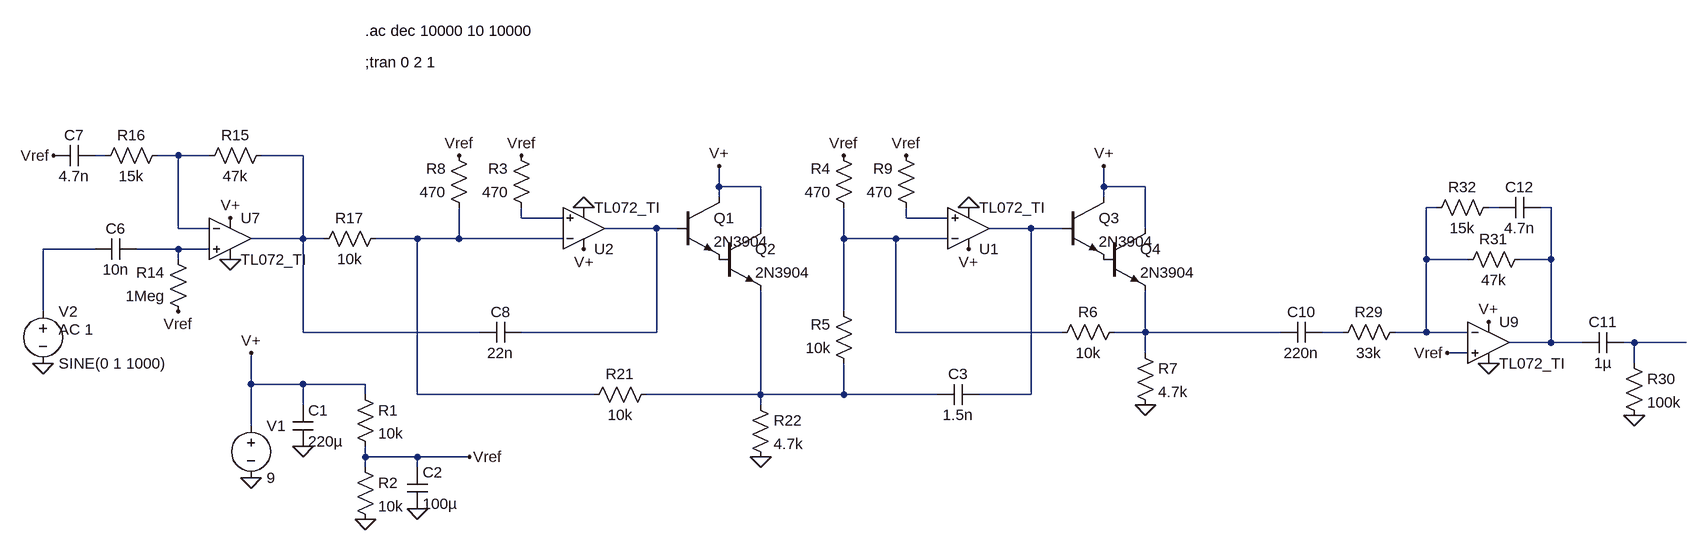
[diagram p0: schematic runooffgroove_tri_vibe_main2.asc]
runooffgroove_tri_vibe_main2.asc, the LTspice schematic file:
Version 4
SHEET 1 2644 680
WIRE 208 -544 192 -544
WIRE 320 -544 288 -544
WIRE 368 -544 320 -544
WIRE 512 -544 448 -544
WIRE 1152 -496 1152 -528
WIRE 1216 -496 1152 -496
WIRE 1744 -496 1744 -528
WIRE 1808 -496 1744 -496
WIRE 1152 -480 1152 -496
WIRE 1744 -480 1744 -496
WIRE 2256 -464 2240 -464
WIRE 2352 -464 2336 -464
WIRE 2432 -464 2416 -464
WIRE 848 -448 848 -464
WIRE 912 -448 848 -448
WIRE 1440 -448 1440 -464
WIRE 1504 -448 1440 -448
WIRE 320 -432 320 -544
WIRE 368 -432 320 -432
WIRE 1056 -432 976 -432
WIRE 1088 -432 1056 -432
WIRE 1216 -432 1216 -496
WIRE 1632 -432 1568 -432
WIRE 1680 -432 1632 -432
WIRE 1808 -432 1808 -496
WIRE 512 -416 512 -544
WIRE 512 -416 432 -416
WIRE 544 -416 512 -416
WIRE 688 -416 624 -416
WIRE 752 -416 752 -464
WIRE 752 -416 688 -416
WIRE 912 -416 752 -416
WIRE 1344 -416 1344 -464
WIRE 1424 -416 1344 -416
WIRE 1504 -416 1424 -416
WIRE 192 -400 112 -400
WIRE 320 -400 256 -400
WIRE 368 -400 320 -400
WIRE 320 -384 320 -400
WIRE 2240 -384 2240 -464
WIRE 2304 -384 2240 -384
WIRE 2432 -384 2432 -464
WIRE 2432 -384 2384 -384
WIRE 112 -304 112 -400
WIRE 1344 -304 1344 -416
WIRE 512 -272 512 -416
WIRE 784 -272 512 -272
WIRE 1056 -272 1056 -432
WIRE 1056 -272 848 -272
WIRE 1424 -272 1424 -416
WIRE 1680 -272 1424 -272
WIRE 1808 -272 1808 -336
WIRE 1808 -272 1760 -272
WIRE 2016 -272 1808 -272
WIRE 2112 -272 2080 -272
WIRE 2240 -272 2240 -384
WIRE 2240 -272 2192 -272
WIRE 2304 -272 2240 -272
WIRE 2432 -256 2432 -384
WIRE 2432 -256 2368 -256
WIRE 2480 -256 2432 -256
WIRE 2560 -256 2544 -256
WIRE 2640 -256 2560 -256
WIRE 1808 -240 1808 -272
WIRE 2304 -240 2272 -240
WIRE 2560 -224 2560 -256
WIRE 432 -192 432 -240
WIRE 512 -192 432 -192
WIRE 608 -192 512 -192
WIRE 608 -176 608 -192
WIRE 688 -176 688 -416
WIRE 960 -176 688 -176
WIRE 1216 -176 1216 -336
WIRE 1216 -176 1040 -176
WIRE 1344 -176 1344 -224
WIRE 1344 -176 1216 -176
WIRE 1488 -176 1344 -176
WIRE 1632 -176 1632 -432
WIRE 1632 -176 1552 -176
WIRE 512 -160 512 -192
WIRE 1216 -160 1216 -176
WIRE 432 -128 432 -192
WIRE 608 -80 608 -96
WIRE 688 -80 608 -80
WIRE 768 -80 688 -80
WIRE 608 -64 608 -80
WIRE 688 -64 688 -80
FLAG 432 -48 0
FLAG 512 -96 0
FLAG 608 16 0
FLAG 688 0 0
FLAG 432 -240 V+
FLAG 768 -80 Vref
FLAG 112 -224 0
FLAG 400 -448 V+
FLAG 400 -384 0
FLAG 320 -304 Vref
FLAG 128 -544 Vref
FLAG 1216 -80 0
FLAG 2336 -288 V+
FLAG 2336 -224 0
FLAG 2272 -240 Vref
FLAG 2560 -144 0
FLAG 944 -464 0
FLAG 944 -400 V+
FLAG 1152 -528 V+
FLAG 1536 -464 0
FLAG 1536 -400 V+
FLAG 1744 -528 V+
FLAG 1808 -160 0
FLAG 752 -544 Vref
FLAG 848 -544 Vref
FLAG 1344 -544 Vref
FLAG 1440 -544 Vref
SYMBOL voltage 432 -144 R0
WINDOW 123 0 0 Left 2
WINDOW 39 0 0 Left 2
SYMATTR InstName V1
SYMATTR Value 9
SYMBOL cap 496 -160 R0
SYMATTR InstName C1
SYMATTR Value 220µ
SYMBOL res 592 -192 R0
SYMATTR InstName R1
SYMATTR Value 10k
SYMBOL res 592 -80 R0
SYMATTR InstName R2
SYMATTR Value 10k
SYMBOL cap 672 -64 R0
SYMATTR InstName C2
SYMATTR Value 100µ
SYMBOL voltage 112 -320 R0
WINDOW 123 24 44 Left 2
WINDOW 39 0 0 Left 2
SYMATTR Value2 AC 1
SYMATTR InstName V2
SYMATTR Value SINE(0 1 1000)
SYMBOL cap 256 -416 R90
WINDOW 0 0 32 VBottom 2
WINDOW 3 32 32 VTop 2
SYMATTR InstName C6
SYMATTR Value 10n
SYMBOL res 336 -288 R180
WINDOW 0 36 76 Left 2
WINDOW 3 36 40 Left 2
SYMATTR InstName R14
SYMATTR Value 1Meg
SYMBOL EXTRA\\AudioOpamp\\TI\\TL072_TI 400 -416 R0
SYMATTR InstName U7
SYMBOL res 464 -560 R90
WINDOW 0 0 56 VBottom 2
WINDOW 3 32 56 VTop 2
SYMATTR InstName R15
SYMATTR Value 47k
SYMBOL res 192 -528 R270
WINDOW 0 32 56 VTop 2
WINDOW 3 0 56 VBottom 2
SYMATTR InstName R16
SYMATTR Value 15k
SYMBOL cap 192 -560 R90
WINDOW 0 0 32 VBottom 2
WINDOW 3 32 32 VTop 2
SYMATTR InstName C7
SYMATTR Value 4.7n
SYMBOL res 640 -432 R90
WINDOW 0 0 56 VBottom 2
WINDOW 3 32 56 VTop 2
SYMATTR InstName R17
SYMATTR Value 10k
SYMBOL cap 848 -288 R90
WINDOW 0 0 32 VBottom 2
WINDOW 3 32 32 VTop 2
SYMATTR InstName C8
SYMATTR Value 22n
SYMBOL res 1056 -192 R90
WINDOW 0 0 56 VBottom 2
WINDOW 3 32 56 VTop 2
SYMATTR InstName R21
SYMATTR Value 10k
SYMBOL res 1200 -176 R0
SYMATTR InstName R22
SYMATTR Value 4.7k
SYMBOL cap 2080 -288 R90
WINDOW 0 0 32 VBottom 2
WINDOW 3 32 32 VTop 2
SYMATTR InstName C10
SYMATTR Value 220n
SYMBOL res 2208 -288 R90
WINDOW 0 0 56 VBottom 2
WINDOW 3 32 56 VTop 2
SYMATTR InstName R29
SYMATTR Value 33k
SYMBOL EXTRA\\AudioOpamp\\TI\\TL072_TI 2336 -256 R0
SYMATTR InstName U9
SYMBOL cap 2544 -272 R90
WINDOW 0 0 32 VBottom 2
WINDOW 3 32 32 VTop 2
SYMATTR InstName C11
SYMATTR Value 1µ
SYMBOL res 2544 -240 R0
SYMATTR InstName R30
SYMATTR Value 100k
SYMBOL res 2400 -400 R90
WINDOW 0 0 56 VBottom 2
WINDOW 3 32 56 VTop 2
SYMATTR InstName R31
SYMATTR Value 47k
SYMBOL res 2352 -480 R90
WINDOW 0 0 56 VBottom 2
WINDOW 3 32 56 VTop 2
SYMATTR InstName R32
SYMATTR Value 15k
SYMBOL cap 2416 -480 R90
WINDOW 0 0 32 VBottom 2
WINDOW 3 32 32 VTop 2
SYMATTR InstName C12
SYMATTR Value 4.7n
SYMBOL EXTRA\\AudioOpamp\\TI\\TL072_TI 944 -432 M180
SYMATTR InstName U2
SYMBOL npn 1088 -480 R0
SYMATTR InstName Q1
SYMATTR Value 2N3904
SYMBOL npn 1152 -432 R0
SYMATTR InstName Q2
SYMATTR Value 2N3904
SYMBOL EXTRA\\AudioOpamp\\TI\\TL072_TI 1536 -432 M180
SYMATTR InstName U1
SYMBOL npn 1680 -480 R0
SYMATTR InstName Q3
SYMATTR Value 2N3904
SYMBOL npn 1744 -432 R0
SYMATTR InstName Q4
SYMATTR Value 2N3904
SYMBOL res 1360 -208 R180
WINDOW 0 36 76 Left 2
WINDOW 3 36 40 Left 2
SYMATTR InstName R5
SYMATTR Value 10k
SYMBOL cap 1552 -192 R90
WINDOW 0 0 32 VBottom 2
WINDOW 3 32 32 VTop 2
SYMATTR InstName C3
SYMATTR Value 1.5n
SYMBOL res 1776 -288 R90
WINDOW 0 0 56 VBottom 2
WINDOW 3 32 56 VTop 2
SYMATTR InstName R6
SYMATTR Value 10k
SYMBOL res 1792 -256 R0
SYMATTR InstName R7
SYMATTR Value 4.7k
SYMBOL res 768 -448 R180
WINDOW 0 36 76 Left 2
WINDOW 3 36 40 Left 2
SYMATTR InstName R8
SYMATTR Value 470
SYMBOL res 864 -448 R180
WINDOW 0 36 76 Left 2
WINDOW 3 36 40 Left 2
SYMATTR InstName R3
SYMATTR Value 470
SYMBOL res 1360 -448 R180
WINDOW 0 36 76 Left 2
WINDOW 3 36 40 Left 2
SYMATTR InstName R4
SYMATTR Value 470
SYMBOL res 1456 -448 R180
WINDOW 0 36 76 Left 2
WINDOW 3 36 40 Left 2
SYMATTR InstName R9
SYMATTR Value 470
TEXT 608 -688 Left 2 !;tran 0 2 1
TEXT 608 -736 Left 2 !.ac dec 10000 10 10000

The netlist it stands for:
* runooffgroove_tri_vibe_main2.asc
V1 V+ 0 9
C1 V+ 0 220µ
R1 V+ Vref 10k
R2 Vref 0 10k
C2 Vref 0 100µ
V2 N013 0 SINE(0 1 1000) AC 1
C6 N014 N013 10n
R14 Vref N014 1Meg
* U7: TL072_TI (symbol EXTRA\AudioOpamp\TI\TL072_TI not available, pins judged from their places): In+=N014 In-=N002 V+=V+ V-=0 OUT=N003
R15 N003 N002 47k
R16 N001 N002 15k
C7 N001 Vref 4.7n
R17 N011 N003 10k
C8 N009 N003 22n
R21 N018 N011 10k
R22 N018 0 4.7k
C10 N016 N015 220n
R29 N004 N016 33k
* U9: TL072_TI (symbol EXTRA\AudioOpamp\TI\TL072_TI not available, pins judged from their places): In+=Vref In-=N004 V+=V+ V-=0 OUT=N006
C11 N017 N006 1µ
R30 N017 0 100k
R31 N006 N004 47k
R32 N005 N004 15k
C12 N006 N005 4.7n
* U2: TL072_TI (symbol EXTRA\AudioOpamp\TI\TL072_TI not available, pins judged from their places): In+=N007 In-=N011 V+=V+ V-=0 OUT=N009
Q1 V+ N009 P001 0 2N3904
Q2 V+ P001 N018 0 2N3904
* U1: TL072_TI (symbol EXTRA\AudioOpamp\TI\TL072_TI not available, pins judged from their places): In+=N008 In-=N012 V+=V+ V-=0 OUT=N010
Q3 V+ N010 P002 0 2N3904
Q4 V+ P002 N015 0 2N3904
R5 N018 N012 10k
C3 N010 N018 1.5n
R6 N015 N012 10k
R7 N015 0 4.7k
R8 N011 Vref 470
R3 N007 Vref 470
R4 N012 Vref 470
R9 N008 Vref 470
.model NPN NPN
.model PNP PNP
.lib standard.bjt
;tran 0 2 1
.ac dec 10000 10 10000
.backanno
.end